# EAGLE design shield (EAGLE 9.5.0)
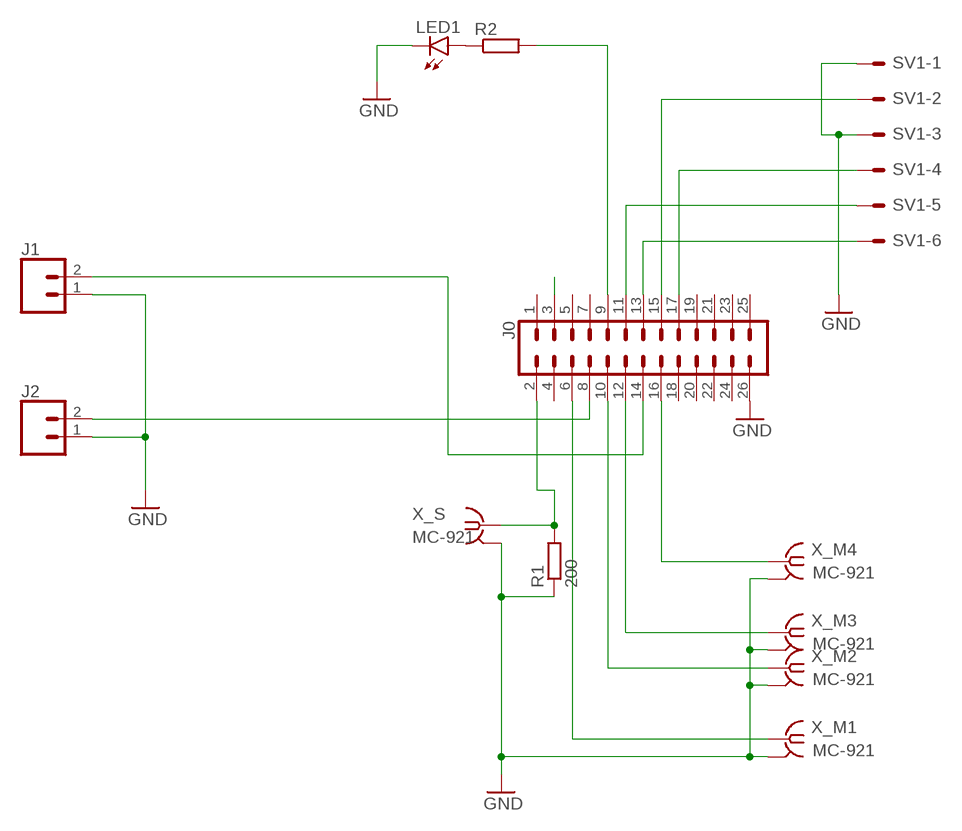
[diagram p0: schematic, sheet 1]

## Parts
J0  CONN_13X22X13  [2X13]
J1  CONN_02  [1X02]
J2  CONN_02  [1X02]
LED1  LEDCHIPLED_0805  [CHIPLED_0805]
R1  200  R-EU_R0805  [R0805]
R2  R-EU_R0805  [R0805]
SV1  ML6E  [ML6]
X_M1  MC-921  [MC-921]
X_M2  MC-921  [MC-921]
X_M3  MC-921  [MC-921]
X_M4  MC-921  [MC-921]
X_S  MC-921  [MC-921]

## Nets
GND: J0.26 J1.1 J2.1 LED1.C R1.1 SV1.1 SV1.3 X_M1.2@1(GND) X_M1.2@2(GND) X_M2.2@1(GND) X_M2.2@2(GND) X_M3.2@1(GND) X_M3.2@2(GND) X_M4.2@1(GND) X_M4.2@2(GND) X_S.2@1(GND) X_S.2@2(GND)
N$1: J0.2 R1.2 X_S.1
N$2: J0.6 X_M1.1
N$3: J0.3
N$4: J0.16 X_M4.1
N$5: J0.10 X_M2.1
N$6: J0.12 X_M3.1
N$7: J0.8 J2.2
N$8: J0.14 J1.2
N$9: J0.17 SV1.4
N$10: J0.15 SV1.2
N$11: J0.13 SV1.6
N$12: J0.11 SV1.5
N$19: LED1.A R2.1
N$20: J0.9 R2.2
Unconnected: J0.1 J0.4 J0.5 J0.7 J0.18 J0.19 J0.20 J0.21 J0.22 J0.23 J0.24 J0.25

## Library data of the parts
J0 = SparkFun-Connectors:CONN_13X2: Multi connection point. Often used as Generic Header-pin footprint for 0.1 inch spaced/style header connections On any of the 0.1 inch spaced packages, you can populate with these: Break Away Headers - Straight <https://www.sparkfun.com/products/116> (PRT-00116) Break Away Male Headers - Right Angle <https://www.sparkfun.com/products/553> (PRT-00553) Female Headers <https://www.sparkfun.com/products/115> (PRT-00115) Break Away Headers - Machine Pin <https://www.sparkfun.com/products/117> (PRT-00117) Break Away Female Headers - Swiss Machine Pin <https://www.sparkfun.com/products/743> (PRT-00743)
J1 J2 = SparkFun-Connectors:CONN_02: Multi connection point. Often used as Generic Header-pin footprint for 0.1 inch spaced/style header connections On any of the 0.1 inch spaced packages, you can populate with these: Break Away Headers - Straight <https://www.sparkfun.com/products/116> (PRT-00116) Break Away Male Headers - Right Angle <https://www.sparkfun.com/products/553> (PRT-00553) Female Headers <https://www.sparkfun.com/products/115> (PRT-00115) Break Away Headers - Machine Pin <https://www.sparkfun.com/products/117> (PRT-00117) Break Away Female Headers - Swiss Machine Pin <https://www.sparkfun.com/products/743> (PRT-00743) For SCREWTERMINALS and SPRING TERMINALS visit here: Screw Terimnals on SparkFun.com <https://www.sparkfun.com/search/results?term=Screw+Terminals> (5mm/3.5mm/2.54mm spacing) This device is also useful as a general connection point to wire up your design to another part of your project. Our various solder wires solder well into these plated through hole pads. Hook-Up Wire - Assortment (Stranded, 22 AWG) <https://www.sparkfun.com/products/11375> (PRT-11375) Hook-Up Wire - Assortment (Solid Core, 22 AWG) <https://www.sparkfun.com/products/11367> (PRT-11367) View the entire wire category on our website here <https://www.sparkfun.com/categories/141> Special notes: Molex polarized connector foot print use with: PRT-08233 with associated crimp pins and housings. 2.54_SCREWTERM for use with PRT-10571. 3.5mm Screw Terminal footprints for PRT-08084 5mm Screw Terminal footprints for use with PRT-08432
LED1 = led:LED: LED OSRAM: - CHIPLED LG R971, LG N971, LY N971, LG Q971, LY Q971, LO R971, LY R971 LH N974, LH R974 LS Q976, LO Q976, LY Q976 LO Q996 - Hyper CHIPLED LW Q18S LB Q993, LB Q99A, LB R99A - SideLED LS A670, LO A670, LY A670, LG A670, LP A670 LB A673, LV A673, LT A673, LW A673 LH A674 LY A675 LS A676, LA A676, LO A676, LY A676, LW A676 LS A679, LY A679, LG A679 - Hyper Micro SIDELED® LS Y876, LA Y876, LO Y876, LY Y876 LT Y87S - SmartLED LW L88C, LW L88S LB L89C, LB L89S, LG L890 LS L89K, LO L89K, LY L89K LS L896, LA L896, LO L896, LY L896 - TOPLED LS T670, LO T670, LY T670, LG T670, LP T670 LSG T670, LSP T670, LSY T670, LOP T670, LYG T670 LG T671, LOG T671, LSG T671 LB T673, LV T673, LT T673, LW T673 LH T674 LS T676, LA T676, LO T676, LY T676, LB T676, LH T676, LSB T676, LW T676 LB T67C, LV T67C, LT T67C, LS T67K, LO T67K, LY T67K, LW E67C LS E67B, LA E67B, LO E67B, LY E67B, LB E67C, LV E67C, LT E67C LW T67C LS T679, LY T679, LG T679 LS T770, LO T770, LY T770, LG T770, LP T770 LB T773, LV T773, LT T773, LW T773 LH T774 LS E675, LA E675, LY E675, LS T675 LS T776, LA T776, LO T776, LY T776, LB T776 LHGB T686 LT T68C, LB T68C - Hyper Mini TOPLED® LB M676 - Mini TOPLED Santana® LG M470 LS M47K, LO M47K, LY M47K Source: http://www.osram.convergy.de LUXEON: - LUMILED® LXK2-PW12-R00, LXK2-PW12-S00, LXK2-PW14-U00, LXK2-PW14-V00 LXK2-PM12-R00, LXK2-PM12-S00, LXK2-PM14-U00 LXK2-PE12-Q00, LXK2-PE12-R00, LXK2-PE12-S00, LXK2-PE14-T00, LXK2-PE14-U00 LXK2-PB12-K00, LXK2-PB12-L00, LXK2-PB12-M00, LXK2-PB14-N00, LXK2-PB14-P00, LXK2-PB14-Q00 LXK2-PR12-L00, LXK2-PR12-M00, LXK2-PR14-Q00, LXK2-PR14-R00 LXK2-PD12-Q00, LXK2-PD12-R00, LXK2-PD12-S00 LXK2-PH12-R00, LXK2-PH12-S00 LXK2-PL12-P00, LXK2-PL12-Q00, LXK2-PL12-R00 Source: www.luxeon.com KINGBRIGHT: KA-3528ASYC Source: www.kingbright.com
R1 R2 = rcl:R-EU_: RESISTOR, European symbol; SPICEPREFIX: R
SV1 = con-ml:ML6E: HARTING; OC_FARNELL: unknown; OC_NEWARK: unknown
X_M1-X_M4 X_S = con-coax:MC-921: COAX. MICROWAVE CONNECTOR O/D diam 2.1 Source: www.tycoelectronics.com .. Electronics .. ENG_CD_1775146_A2.pdf; OC_FARNELL: unknown; OC_NEWARK: unknown

## Board
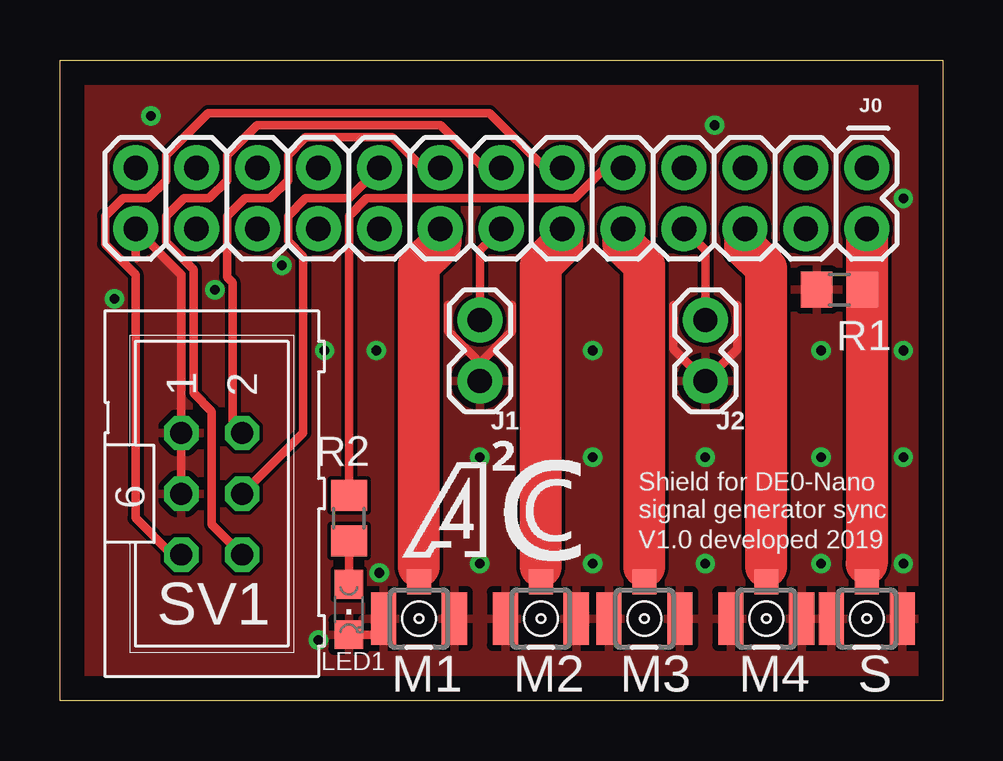
[diagram p1: board, top side]
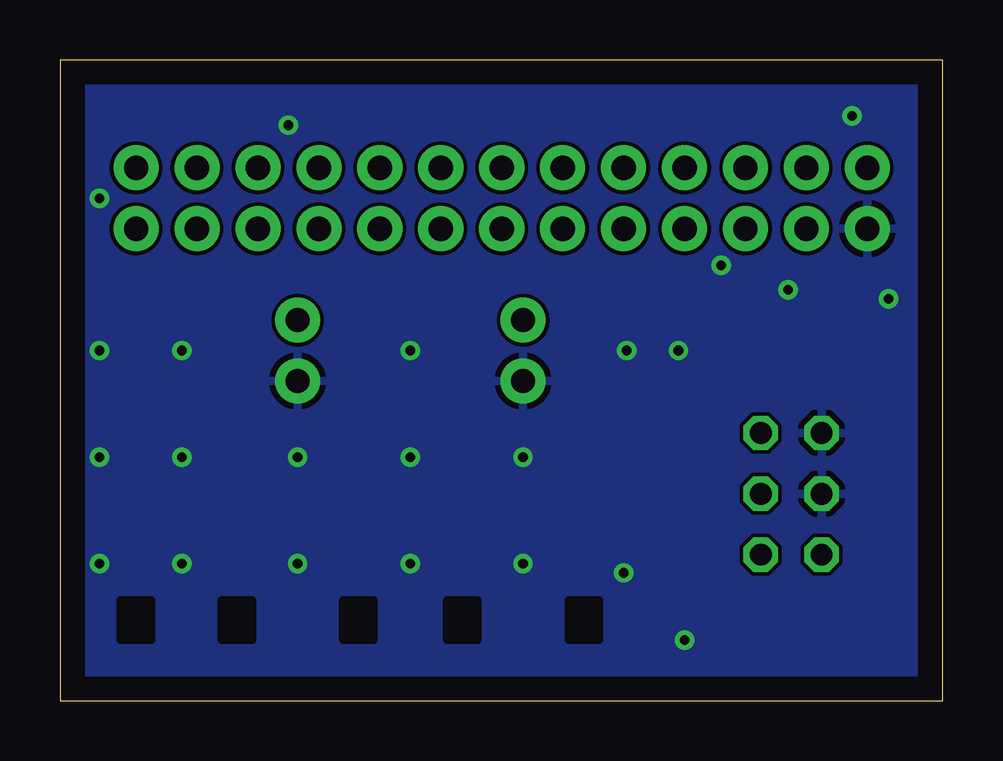
[diagram p2: board, bottom side, seen from below]

Size 36.81 x 26.72 mm. Coordinates in mm from the lower left corner, seen from the top.
Outline: 36.81,0 0,0 0,26.72 36.81,26.72 36.81,0
Copper layers (1*16): Top 0.035mm / dielectric 1mm / Bottom 0.035mm
Design rules "default *": minimum track width 6mil, minimum drill 0.35mm, track to track 6mil, track to pad 6mil, pad to pad 6mil, via to via 6mil, smd to smd 6mil, copper to edge 40mil, drill to drill 6mil, minimum pad ring 10mil, minimum via ring 8mil, stop-mask expansion 4mil, vias tented up to drill 0mil, thermal gap 10mil
tKeepout: area 33,2.5 to 34.3,4.2; area 28.8,2.5 to 30.1,4.2; area 23.7,2.5 to 25,4.2; area 19.4,2.5 to 20.7,4.2; area 14.3,2.5 to 15.6,4.2
tRestrict: area 33,2.5 to 34.3,4.2; area 28.8,2.5 to 30.1,4.2; area 23.7,2.5 to 25,4.2; area 19.4,2.5 to 20.7,4.2; area 14.3,2.5 to 15.6,4.2
bRestrict: area 33,2.5 to 34.3,4.2; area 28.8,2.5 to 30.1,4.2; area 23.7,2.5 to 25,4.2; area 19.4,2.5 to 20.7,4.2; area 14.3,2.5 to 15.6,4.2

### Footprints (pad centres in the part's own frame; a part is rotated, then mirrored left to right if it is on the bottom)
2X13 = drill 1.016 pad 1.88: 1 0,0; 2 0,2.54; 3 2.54,0; 4 2.54,2.54; 5 5.08,0; 6 5.08,2.54; 7 7.62,0; 8 7.62,2.54; 9 10.16,0; 10 10.16,2.54; 11 12.7,0; 12 12.7,2.54; 13 15.24,0; 14 15.24,2.54; 15 17.78,0; 16 17.78,2.54; 17 20.32,0; 18 20.32,2.54; 19 22.86,0; 20 22.86,2.54; 21 25.4,0; 22 25.4,2.54; 23 27.94,0; 24 27.94,2.54; 25 30.48,0; 26 30.48,2.54
1X02 = drill 1.016 pad 1.88: 1 0,0; 2 2.54,0
CHIPLED_0805 = smd 1.2 x 1.2: A 0,-1.05; C 0,1.05
R0805 = smd 1.3 x 1.5: 1 -0.95,0; 2 0.95,0
ML6 = drill 0.914 octagon: 1 -2.54,-1.27; 2 -2.54,1.27; 3 0,-1.27; 4 0,1.27; 5 2.54,-1.27; 6 2.54,1.27
MC-921 = smd 1 x 1.05: 1 0,1.528 | smd 1.05 x 2.2: 2@1 -1.475,0; 2@2 1.475,0

### Placement (x,y rotation side)
J0  33.64,22.23 180 top
J1  17.51,13.34 90 top
J2  26.9,13.34 90 top
LED1  12.05,3.81 180 top
R1  32.49,17.14 0 top
R2  12.05,7.62 90 top
SV1  6.33,8.64 270 top
X_M1  29.44,3.43 0 top
X_M2  24.36,3.43 0 top
X_M3  20.05,3.43 0 top
X_M4  14.97,3.43 0 top
X_S  33.64,3.43 0 top

### Tracks (layer width: path | path; a pad name or v marks a point on that pad's centre or on a via)
GND  (via drill 0.4)
  Top 0.356: LED1.C 13.28,2.76 13.32,2.79 | 5.06,8.25 5.06,17.78 J0.26 3.16,18.5 3.2,18.46 | 17.51,14.08 18.85,15.42 18.85,16.51 | J1.1 17.51,14.08 | 17.51,14.08 16.17,15.42 16.17,16.51 | 25.57,16.51 25.57,14.67 J2.1 28.24,14.67 28.24,16.51
  other vias: 31.73,14.61 31.73,5.71 26.9,5.71 22.21,5.71 22.21,14.61 17.51,5.71 13.19,14.61 31.73,10.16 26.9,10.16 22.21,10.16 17.51,10.16 35.16,14.61 35.16,5.71 35.16,10.16 10.78,2.54 6.46,17.14 9.25,18.16 11.03,14.61 13.32,5.33 35.16,20.95 27.29,24 3.79,24.38 2.27,16.76
  pour Top: -0.02,0 -0.02,26.67 36.81,26.67 36.81,0
  pour Bottom: -0.02,26.67 -0.02,0 36.81,0 36.81,26.67
N$1
  Top 0.254: 33.64,5.71 X_S.1 | R1.2 33.64,17.34 J0.2
  Top 1.742: J0.2 33.64,5.71
N$2
  Top 0.254: X_M1.1 29.44,5.59
  Top 1.742: J0.6 28.56,18.92 29.44,18.03 29.44,5.59
N$4
  Top 0.254: X_M4.1 14.97,5.59
  Top 1.742: J0.16 15.86,19.05 14.97,18.16 14.97,5.59
N$5
  Top 0.254: X_M2.1 24.36,5.59
  Top 1.742: J0.10 23.47,19.05 24.36,18.16 24.36,5.59
N$6
  Top 0.254: X_M3.1 20.05,5.59
  Top 1.742: J0.12 20.93,19.05 20.05,18.16 20.05,5.59
N$7
  Top 0.356: J0.8 26.9,18.8 J2.2
N$8
  Top 0.356: J0.14 17.51,18.8 J1.2
N$9
  Top 0.356: J0.17 12.05,20.95 10.25,20.95 9.5,20.21 9.5,19.16 10.14,18.52 10.14,11.18 SV1.4
N$10
  Top 0.356: J0.15 15.11,22.23 13.84,23.49 10.25,23.49 9.5,22.75 9.5,21.7 8.76,20.95 7.71,20.95 6.96,20.21 6.96,17.67 7.19,17.45 7.19,11.59 SV1.2
N$11
  Top 0.356: J0.13 17.65,22.23 15.87,24 8.22,24 6.96,22.75 6.96,21.7 6.22,20.95 5.17,20.95 4.43,20.21 4.43,19.13 5.57,17.99 5.57,12.83 6.33,12.07 6.33,7.37 SV1.6
N$12
  Top 0.356: J0.11 20.19,22.23 17.91,24.51 6.19,24.51 4.43,22.75 4.43,21.7 3.68,20.95 2.63,20.95 1.89,20.21 1.89,19.05 3.16,17.78 3.16,7.62 4.68,6.1 SV1.5
N$19
  Top 0.356: R2.1 LED1.A
N$20
  Top 0.356: J0.9 22.73,22.23 21.46,20.95 12.79,20.95 12.05,20.21 R2.2

### Text on the board
tPlace: Shield for DE0-Nano / signal generator sync | V1.0 developed 2019 | M1 | M2 | M3 | M4 | S